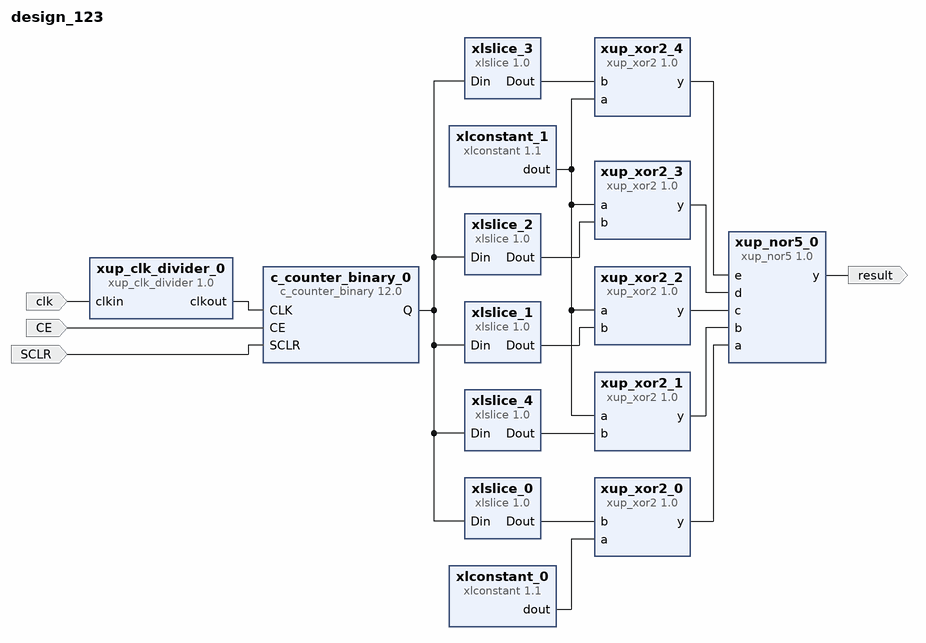
[diagram p0: block diagram of the top level]
# Vivado block design design_123, xc7a35tcpg236-1, Vivado 2018.2
create_bd_design design_123

create_bd_port -dir I -type clk clk
create_bd_port -dir O result
create_bd_port -dir I CE
create_bd_port -dir I SCLR

create_bd_cell -type ip -vlnv xilinx.com:ip:c_counter_binary:12.0 c_counter_binary_0
set_property -dict {CONFIG.CE true CONFIG.SCLR true} [get_bd_cells c_counter_binary_0]
create_bd_cell -type ip -vlnv xilinx.com:ip:xlconstant:1.1 xlconstant_0
set_property -dict {CONFIG.CONST_VAL 0} [get_bd_cells xlconstant_0]
create_bd_cell -type ip -vlnv xilinx.com:ip:xlconstant:1.1 xlconstant_1
create_bd_cell -type ip -vlnv xilinx.com:ip:xlslice:1.0 xlslice_0
set_property -dict {CONFIG.DIN_TO 0 CONFIG.DIN_FROM 0 CONFIG.DIN_WIDTH 16} [get_bd_cells xlslice_0]
create_bd_cell -type ip -vlnv xilinx.com:ip:xlslice:1.0 xlslice_1
set_property -dict {CONFIG.DIN_TO 2 CONFIG.DIN_FROM 2 CONFIG.DIN_WIDTH 16 CONFIG.DOUT_WIDTH 1} [get_bd_cells xlslice_1]
create_bd_cell -type ip -vlnv xilinx.com:ip:xlslice:1.0 xlslice_2
set_property -dict {CONFIG.DIN_TO 3 CONFIG.DIN_FROM 3 CONFIG.DIN_WIDTH 16 CONFIG.DOUT_WIDTH 1} [get_bd_cells xlslice_2]
create_bd_cell -type ip -vlnv xilinx.com:ip:xlslice:1.0 xlslice_3
set_property -dict {CONFIG.DIN_TO 4 CONFIG.DIN_FROM 4 CONFIG.DIN_WIDTH 16 CONFIG.DOUT_WIDTH 1} [get_bd_cells xlslice_3]
create_bd_cell -type ip -vlnv xilinx.com:ip:xlslice:1.0 xlslice_4
set_property -dict {CONFIG.DIN_TO 1 CONFIG.DIN_FROM 1 CONFIG.DIN_WIDTH 16 CONFIG.DOUT_WIDTH 1} [get_bd_cells xlslice_4]
create_bd_cell -type ip -vlnv xilinx.com:XUP:xup_clk_divider:1.0 xup_clk_divider_0
set_property -dict {CONFIG.SIZE 100000000} [get_bd_cells xup_clk_divider_0]
create_bd_cell -type ip -vlnv xilinx.com:XUP:xup_nor5:1.0 xup_nor5_0
create_bd_cell -type ip -vlnv xilinx.com:XUP:xup_xor2:1.0 xup_xor2_0
create_bd_cell -type ip -vlnv xilinx.com:XUP:xup_xor2:1.0 xup_xor2_1
create_bd_cell -type ip -vlnv xilinx.com:XUP:xup_xor2:1.0 xup_xor2_2
create_bd_cell -type ip -vlnv xilinx.com:XUP:xup_xor2:1.0 xup_xor2_3
create_bd_cell -type ip -vlnv xilinx.com:XUP:xup_xor2:1.0 xup_xor2_4

# ---- connections ----

connect_bd_net [get_bd_pins c_counter_binary_0/Q] \
  [get_bd_pins xlslice_0/Din] [get_bd_pins xlslice_4/Din] [get_bd_pins xlslice_1/Din] [get_bd_pins xlslice_2/Din] \
  [get_bd_pins xlslice_3/Din]
connect_bd_net [get_bd_ports clk] [get_bd_pins xup_clk_divider_0/clkin]
connect_bd_net [get_bd_pins xlconstant_0/dout] [get_bd_pins xup_xor2_0/a]
connect_bd_net [get_bd_pins xlconstant_1/dout] \
  [get_bd_pins xup_xor2_1/a] [get_bd_pins xup_xor2_2/a] [get_bd_pins xup_xor2_3/a] [get_bd_pins xup_xor2_4/a]
connect_bd_net [get_bd_pins xlslice_0/Dout] [get_bd_pins xup_xor2_0/b]
connect_bd_net [get_bd_pins xlslice_1/Dout] [get_bd_pins xup_xor2_2/b]
connect_bd_net [get_bd_pins xlslice_2/Dout] [get_bd_pins xup_xor2_3/b]
connect_bd_net [get_bd_pins xlslice_3/Dout] [get_bd_pins xup_xor2_4/b]
connect_bd_net [get_bd_pins xlslice_4/Dout] [get_bd_pins xup_xor2_1/b]
connect_bd_net [get_bd_pins xup_clk_divider_0/clkout] [get_bd_pins c_counter_binary_0/CLK]
connect_bd_net [get_bd_pins xup_nor5_0/y] [get_bd_ports result]
connect_bd_net [get_bd_pins xup_xor2_0/y] [get_bd_pins xup_nor5_0/a]
connect_bd_net [get_bd_pins xup_xor2_1/y] [get_bd_pins xup_nor5_0/b]
connect_bd_net [get_bd_pins xup_xor2_2/y] [get_bd_pins xup_nor5_0/c]
connect_bd_net [get_bd_pins xup_xor2_3/y] [get_bd_pins xup_nor5_0/d]
connect_bd_net [get_bd_pins xup_xor2_4/y] [get_bd_pins xup_nor5_0/e]
connect_bd_net [get_bd_ports CE] [get_bd_pins c_counter_binary_0/CE]
connect_bd_net [get_bd_ports SCLR] [get_bd_pins c_counter_binary_0/SCLR]

validate_bd_design
save_bd_design
